# Altium project SDRdrum_Arty_RevB.PrjPcb
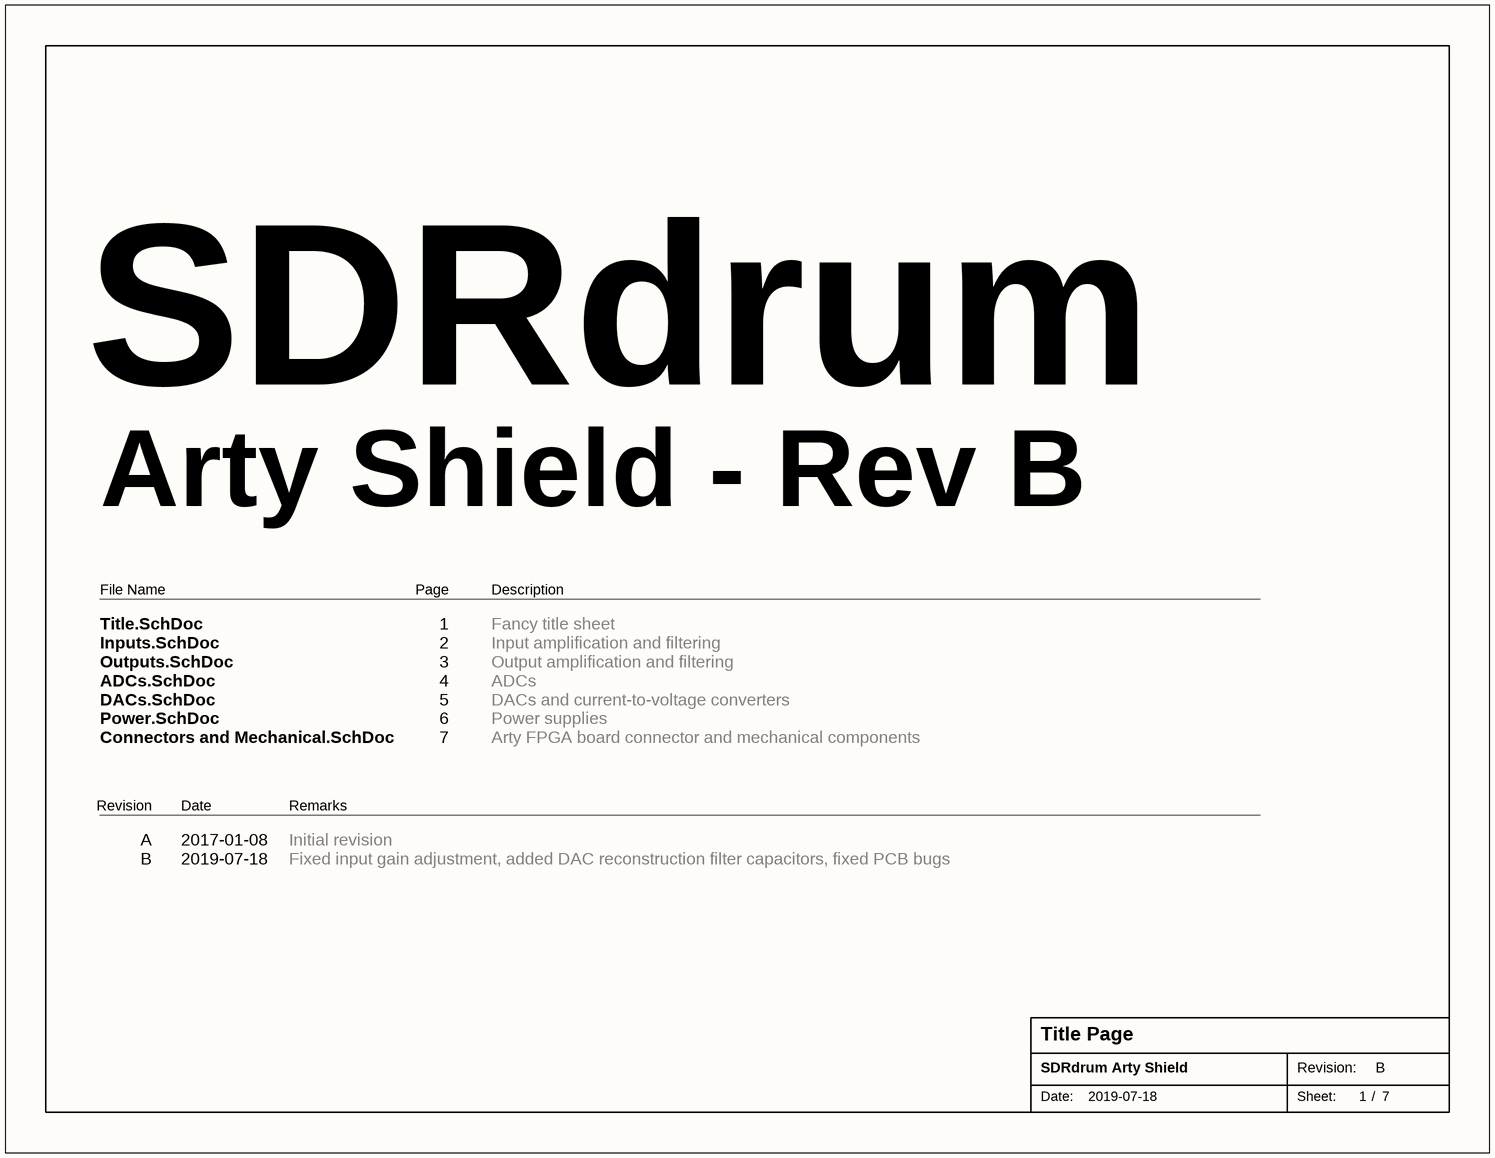
[diagram p0: Title.SchDoc]
ProjectRevision: B
7 sheets, 111 parts. Net scope: global (net labels, ports and power ports of the same name join across sheets).
Board file: SDRdrum_Arty_RevB.PcbDoc
Sheets:
  Title.SchDoc
  Inputs.SchDoc
  Outputs.SchDoc
  ADCs.SchDoc
  DACs.SchDoc
  Power.SchDoc
  Connectors and Mechanical.SchDoc

## Sheet Title.SchDoc: Title Page
size Letter; Date: 2019-07-18; DocumentNumber: 1; Revision: B; SheetNumber: 1; SheetTotal: 7; ProjectTitle: SDRdrum Arty Shield; PageSetup: Record=PageOptions|CenterHorizontal=True|CenterVertical=True|PrintScale=0.98|XCorrection=1.00|YCorrection=1.00|PrintKind=2|BorderSize=5000000|LeftOffset=0|BottomOffset=0|Orientation=2|PaperLength=1000|PaperWidth=1000|Scale=100|PaperSource=7|PrintQuality=-3|MediaType=1|DitherType=10|PrintScaleMode=1|PaperKind=Tabloid|PaperIndex=3

### Notes on the sheet
- SDRdrum
- Arty Shield - Rev B
- File Name
- Page
- Description
- Title.SchDoc
  Inputs.SchDoc
  Outputs.SchDoc
  ADCs.SchDoc
  DACs.SchDoc
  Power.SchDoc
  Connectors and Mechanical.SchDoc
- 1
  2
  3
  4
  5
  6
  7
- Fancy title sheet
  Input amplification and filtering
  Output amplification and filtering
  ADCs
  DACs and current-to-voltage converters
  Power supplies
  Arty FPGA board connector and mechanical components
- Revision
- Date
- Remarks
- A
  B
- 2017-01-08
  2019-07-18
- Initial revision
  Fixed input gain adjustment, added DAC reconstruction filter capacitors, fixed PCB bugs
- Date:
- Revision:
- Sheet:
- /

## Sheet Inputs.SchDoc: Inputs
size Letter; Date: 2019-07-18; DocumentNumber: 2; Revision: B; SheetNumber: 2; SheetTotal: 7; ProjectTitle: SDRdrum Arty Shield; PageSetup: Record=PageOptions|CenterHorizontal=True|CenterVertical=True|PrintScale=0.98|XCorrection=1.00|YCorrection=1.00|PrintKind=2|BorderSize=5000000|LeftOffset=0|BottomOffset=0|Orientation=2|PaperLength=1000|PaperWidth=1000|Scale=100|PaperSource=7|PrintQuality=-3|MediaType=1|DitherType=10|PrintScaleMode=1|PaperKind=Tabloid|PaperIndex=3
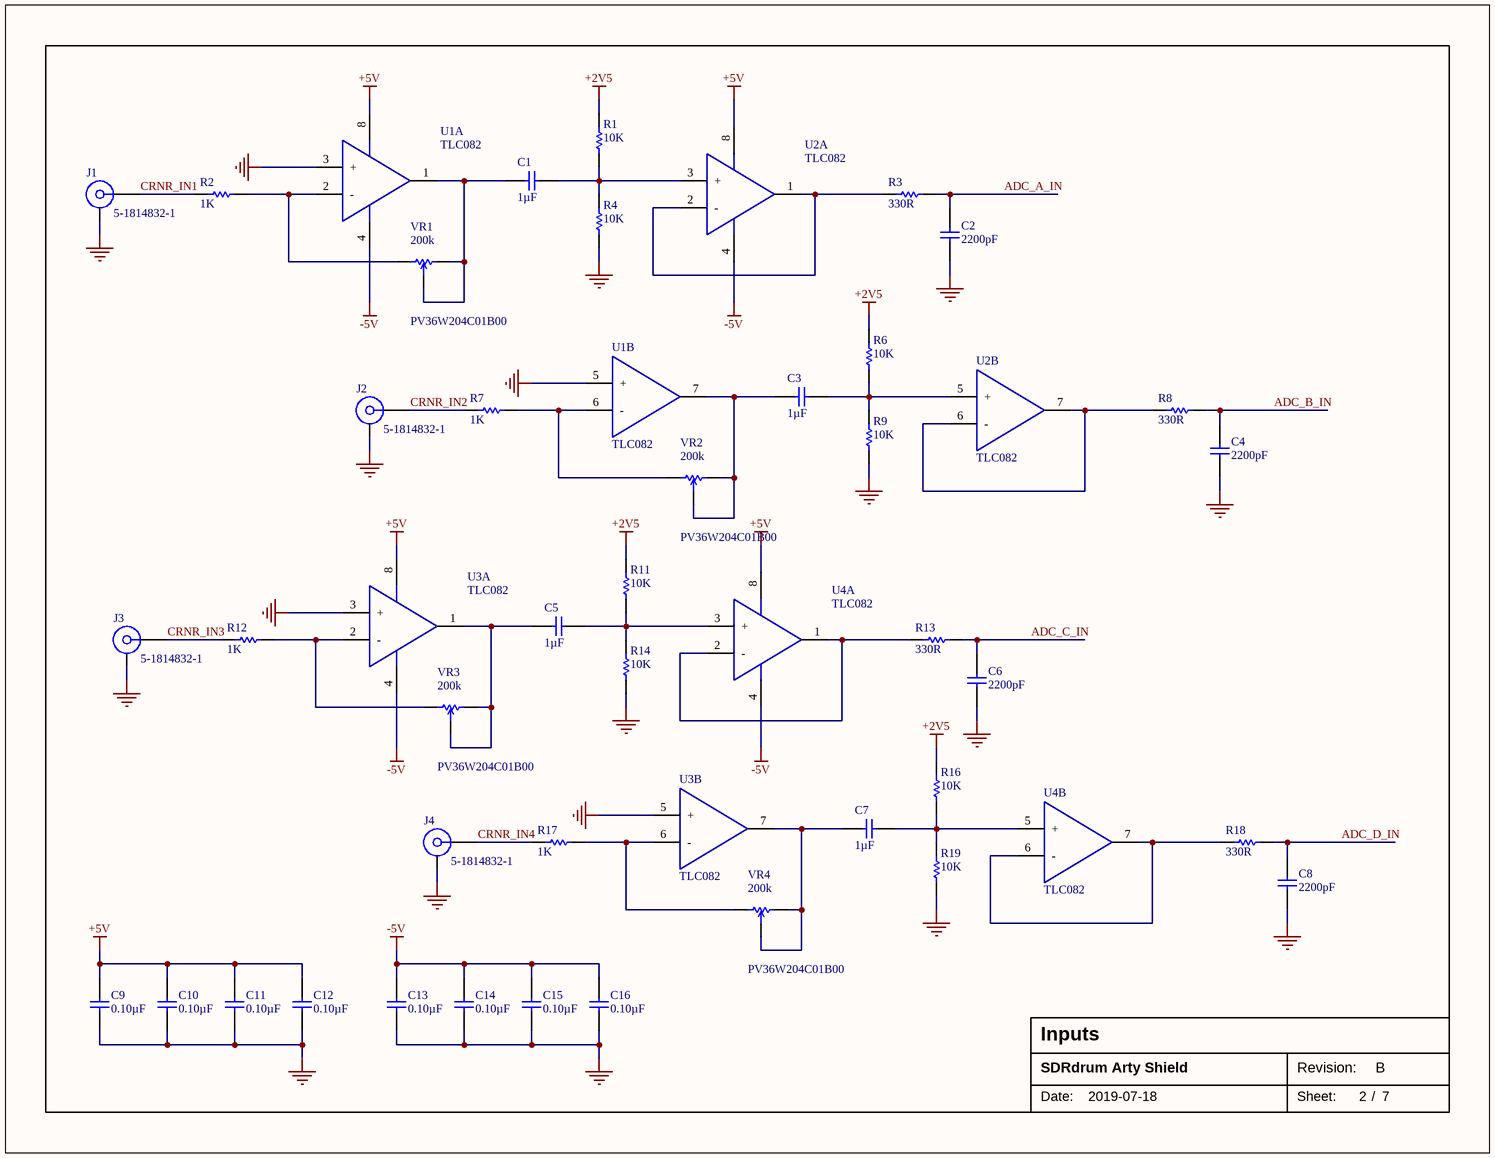
[diagram p1: Inputs.SchDoc]

### Parts
C1  value 1µF  [CAP-0402-M]  (hidden comment: Capacitor)
C2  value 2200pF  [CAP-0402-M]  (hidden comment: CAP 2200pF ±10% 25V 0402 X7R)
C3  value 1µF  [CAP-0402-M]  (hidden comment: Capacitor)
C4  value 2200pF  [CAP-0402-M]  (hidden comment: CAP 2200pF ±10% 25V 0402 X7R)
C5  value 1µF  [CAP-0402-M]  (hidden comment: Capacitor)
C6  value 2200pF  [CAP-0402-M]  (hidden comment: CAP 2200pF ±10% 25V 0402 X7R)
C7  value 1µF  [CAP-0402-M]  (hidden comment: Capacitor)
C8  value 2200pF  [CAP-0402-M]  (hidden comment: CAP 2200pF ±10% 25V 0402 X7R)
C9  value 0.10µF  [CAP-0402-M]  (hidden comment: Capacitor)
C10  value 0.10µF  [CAP-0402-M]  (hidden comment: Capacitor)
C11  value 0.10µF  [CAP-0402-M]  (hidden comment: Capacitor)
C12  value 0.10µF  [CAP-0402-M]  (hidden comment: Capacitor)
C13  value 0.10µF  [CAP-0402-M]  (hidden comment: Capacitor)
C14  value 0.10µF  [CAP-0402-M]  (hidden comment: Capacitor)
C15  value 0.10µF  [CAP-0402-M]  (hidden comment: Capacitor)
C16  value 0.10µF  [CAP-0402-M]  (hidden comment: Capacitor)
J1  5-1814832-1  [5-1814832-1]
J2  5-1814832-1  [5-1814832-1]
J3  5-1814832-1  [5-1814832-1]
J4  5-1814832-1  [5-1814832-1]
R1  value 10K  [RES-0603-M]  (hidden comment: RES 10K 1% 1/10 W 0603 ±100ppm/°C)
R2  value 1K  [RES-0603-M]  (hidden comment: Resistor)
R3  value 330R  [RES-0603-M]  (hidden comment: RES 330R 1% 1/10 W 0603 ±100ppm/°C)
R4  value 10K  [RES-0603-M]  (hidden comment: RES 10K 1% 1/10 W 0603 ±100ppm/°C)
R6  value 10K  [RES-0603-M]  (hidden comment: RES 10K 1% 1/10 W 0603 ±100ppm/°C)
R7  value 1K  [RES-0603-M]  (hidden comment: Resistor)
R8  value 330R  [RES-0603-M]  (hidden comment: RES 330R 1% 1/10 W 0603 ±100ppm/°C)
R9  value 10K  [RES-0603-M]  (hidden comment: RES 10K 1% 1/10 W 0603 ±100ppm/°C)
R11  value 10K  [RES-0603-M]  (hidden comment: RES 10K 1% 1/10 W 0603 ±100ppm/°C)
R12  value 1K  [RES-0603-M]  (hidden comment: Resistor)
R13  value 330R  [RES-0603-M]  (hidden comment: RES 330R 1% 1/10 W 0603 ±100ppm/°C)
R14  value 10K  [RES-0603-M]  (hidden comment: RES 10K 1% 1/10 W 0603 ±100ppm/°C)
R16  value 10K  [RES-0603-M]  (hidden comment: RES 10K 1% 1/10 W 0603 ±100ppm/°C)
R17  value 1K  [RES-0603-M]  (hidden comment: Resistor)
R18  value 330R  [RES-0603-M]  (hidden comment: RES 330R 1% 1/10 W 0603 ±100ppm/°C)
R19  value 10K  [RES-0603-M]  (hidden comment: RES 10K 1% 1/10 W 0603 ±100ppm/°C)
U1  TLC082  [SOIC127P600X175-8M]  (parts A,B of 4)
U2  TLC082  [SOIC127P600X175-8M]  (parts A,B of 4)
U3  TLC082  [SOIC127P600X175-8M]  (parts A,B of 4)
U4  TLC082  [SOIC127P600X175-8M]  (parts A,B of 4)
VR1  PV36W204C01B00  value 200k  [PV36W]
VR2  PV36W204C01B00  value 200k  [PV36W]
VR3  PV36W204C01B00  value 200k  [PV36W]
VR4  PV36W204C01B00  value 200k  [PV36W]

### Nets
+2V5: R1.2 R6.2 R11.2 R16.2
+5V: C9.1 C10.1 C11.1 C12.1 U1.8(NC) U2.8(NC) U3.8(NC) U4.8(NC)
-5V: C13.1 C14.1 C15.1 C16.1 U1.4(V-) U2.4(V-) U3.4(V-) U4.4(V-)
GND: C2.1 C4.1 C6.1 C8.1 C9.2 C10.2 C11.2 C12.2 C13.2 C14.2 C15.2 C16.2 J1.MH J2.MH J3.MH J4.MH R4.1 R9.1 R14.1 R19.1 U1.3(+) U1.5(+) U3.3(+) U3.5(+)
ADC_A_IN: C2.2 R3.2
ADC_B_IN: C4.2 R8.2
ADC_C_IN: C6.2 R13.2
ADC_D_IN: C8.2 R18.2
CRNR_IN1: J1.1 R2.2
CRNR_IN2: J2.1 R7.2
CRNR_IN3: J3.1 R12.2
CRNR_IN4: J4.1 R17.2
NetC1_1: C1.1 U1.1(NC) VR1.2 VR1.3
NetC1_2: C1.2 R1.1 R4.2 U2.3(+)
NetC3_1: C3.1 U1.7(OUT1) VR2.2 VR2.3
NetC3_2: C3.2 R6.1 R9.2 U2.5(+)
NetC5_1: C5.1 U3.1(NC) VR3.2 VR3.3
NetC5_2: C5.2 R11.1 R14.2 U4.3(+)
NetC7_1: C7.1 U3.7(OUT1) VR4.2 VR4.3
NetC7_2: C7.2 R16.1 R19.2 U4.5(+)
NetR2_1: R2.1 U1.2(-) VR1.1
NetR3_1: R3.1 U2.1(NC) U2.2(-)
NetR7_1: R7.1 U1.6(-) VR2.1
NetR8_1: R8.1 U2.6(-) U2.7(OUT1)
NetR12_1: R12.1 U3.2(-) VR3.1
NetR13_1: R13.1 U4.1(NC) U4.2(-)
NetR17_1: R17.1 U3.6(-) VR4.1
NetR18_1: R18.1 U4.6(-) U4.7(OUT1)

### Notes on the sheet
- Date:
- Revision:
- Sheet:
- /

### Library data of the parts
C1 C3 C5 C7 = CC0402KRX5R6BB105: Manufacturer: Yageo; Manufacturer Series: CC; Tolerance: ±10%; Voltage: 10V; Temperature Coefficient: X5R; Part Number: CC0402KRX5R6BB105; Component Type: Standard; Package: 0402; Temperature Range: -55°C ~ 85°C; Supplier 1: Digi-Key; Supplier Part Number 1: 311-1439-1-ND
C2 C4 C6 C8 = CC0402KRX7R8BB222: Manufacturer: Yageo; Manufacturer Series: CC; Part Number: CC0402KRX7R8BB222; Component Type: Standard; Tolerance: ±10%; Voltage: 25V; Package: 0402; Temperature Coefficient: X7R; Temperature Range: -55°C ~ 125°C; Supplier 1: Digi-Key; Supplier Part Number 1: 311-1714-1-ND
C9-C16 = CC0402KRX5R6BB104: Manufacturer: Yageo; Manufacturer Series: CC; Tolerance: ±10%; Voltage: 10V; Temperature Coefficient: X5R; Part Number: CC0402KRX5R6BB104; Component Type: Standard; Package: 0402; Temperature Range: -55°C ~ 85°C; Supplier 1: Digi-Key; Supplier Part Number 1: 311-1336-1-ND
R1 R4 R6 R9 R11 R14 R16 R19 = RC0603FR-0710KL: Manufacturer: Yageo; Manufacturer Series: RC; Power: 1/10 W; Part Number: RC0603FR-0710KL; Component Type: Standard; Tolerance: 1%; Package: 0603; Temperature Coefficient: ±100ppm/°C; Temperature Range: -55°C ~ 155°C; Supplier 1: Digi-Key; Supplier Part Number 1: 311-10.0KHRCT-ND
R2 R7 R12 R17 = RC0603FR-071KL: Manufacturer: Yageo; Manufacturer Series: RC; Tolerance: 1%; Power: 1/10 W; Temperature Coefficient: ±100ppm/°C; Part Number: RC0603FR-071KL; Component Type: Standard; Package: 0603; Temperature Range: -55°C ~ 155°C; Supplier 1: Digi-Key; Supplier Part Number 1: 311-1.00KHRCT-ND
R3 R8 R13 R18 = RC0603FR-07330RL: Manufacturer: Yageo; Manufacturer Series: RC; Power: 1/10 W; Part Number: RC0603FR-07330RL; Component Type: Standard; Tolerance: 1%; Package: 0603; Temperature Coefficient: ±100ppm/°C; Temperature Range: -55°C ~ 155°C; Supplier 1: Digi-Key; Supplier Part Number 1: 311-330HRCT-ND
U1-U4 = TLC082: 36-V, PrOperational Amplifiers, 8-Pin SOIC
VR1-VR4 = PV36W204C01B00: Potentiometer, 200 k, 10%, 0.5 W, Through Hole; Supplier 1: Digi-Key; Supplier Part Number 1: 490-2882-ND

## Sheet Outputs.SchDoc: Outputs
size Letter; Date: 2019-07-18; DocumentNumber: 3; Revision: B; SheetNumber: 3; SheetTotal: 7; ProjectTitle: SDRdrum Arty Shield; PageSetup: Record=PageOptions|CenterHorizontal=True|CenterVertical=True|PrintScale=0.98|XCorrection=1.00|YCorrection=1.00|PrintKind=2|BorderSize=5000000|LeftOffset=0|BottomOffset=0|Orientation=2|PaperLength=1000|PaperWidth=1000|Scale=100|PaperSource=7|PrintQuality=-3|MediaType=1|DitherType=10|PrintScaleMode=1|PaperKind=Tabloid|PaperIndex=3
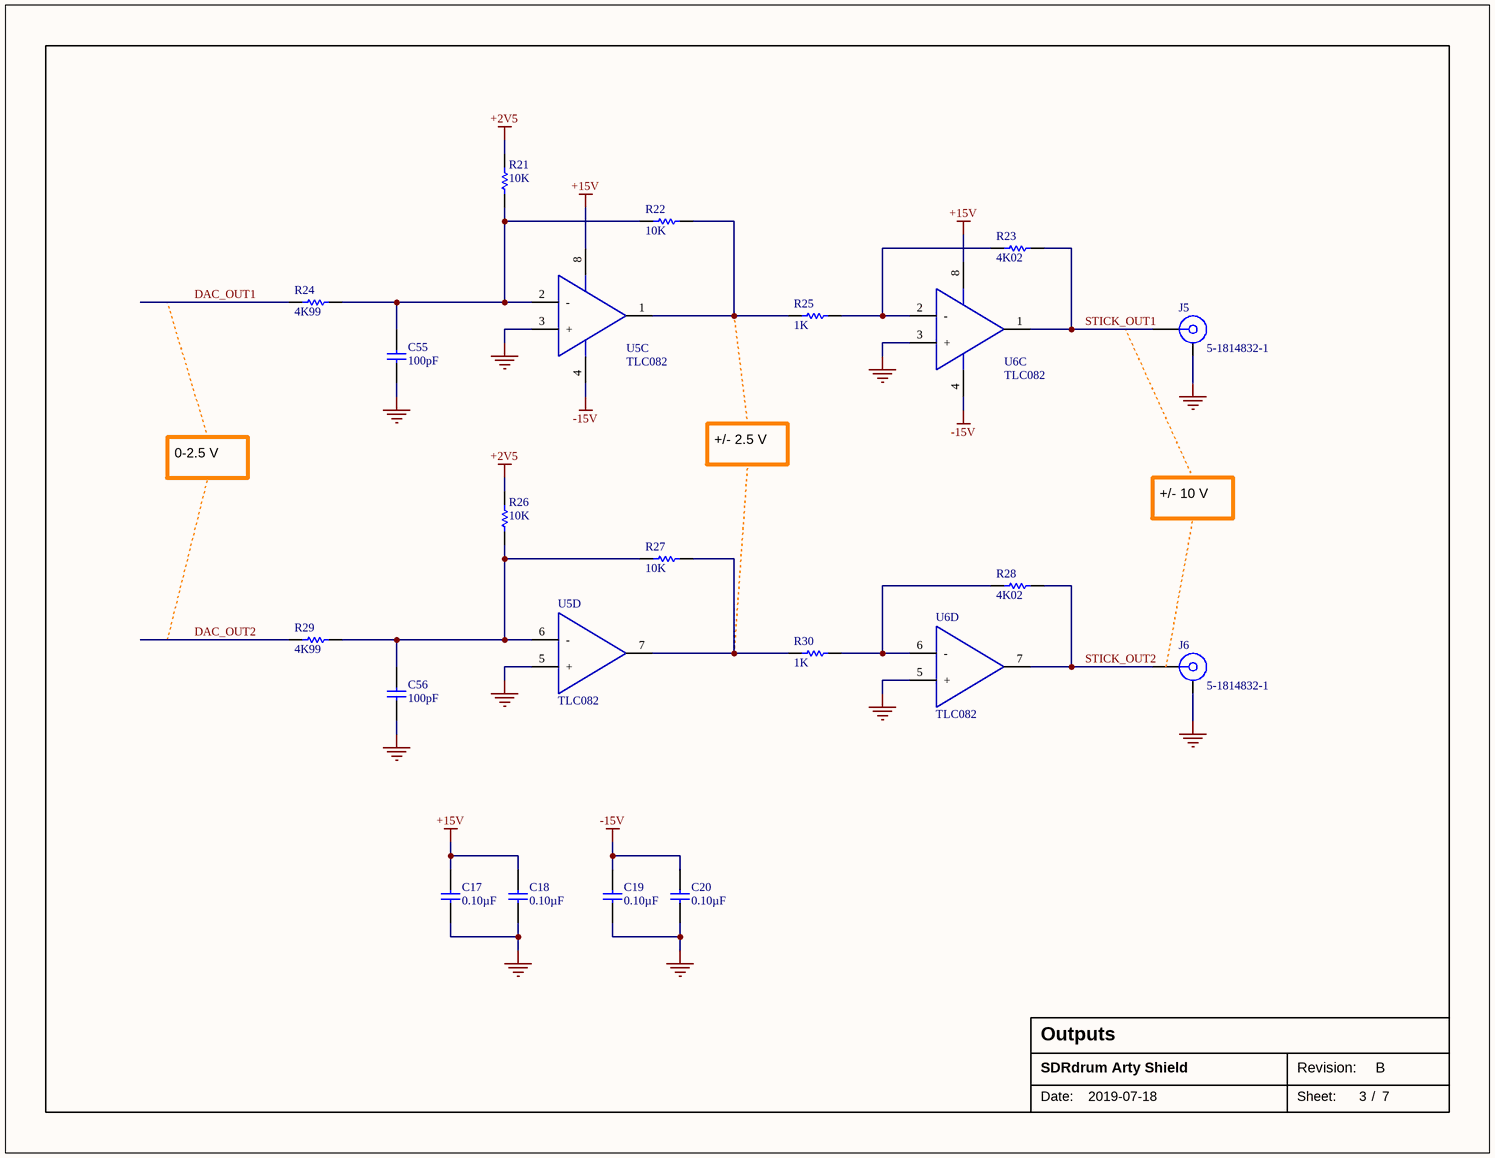
[diagram p2: Outputs.SchDoc]

### Parts
C17  value 0.10µF  [CAP-0402-M]  (hidden comment: Capacitor)
C18  value 0.10µF  [CAP-0402-M]  (hidden comment: Capacitor)
C19  value 0.10µF  [CAP-0402-M]  (hidden comment: Capacitor)
C20  value 0.10µF  [CAP-0402-M]  (hidden comment: Capacitor)
C55  value 100pF  [CAP-0603-M]  (hidden comment: CAP 100pF ±5% 50V 0603 C0G, NP0)
C56  value 100pF  [CAP-0603-M]  (hidden comment: CAP 100pF ±5% 50V 0603 C0G, NP0)
J5  5-1814832-1  [5-1814832-1]
J6  5-1814832-1  [5-1814832-1]
R21  value 10K  [RES-0603-M]  (hidden comment: RES 10K 1% 1/10 W 0603 ±100ppm/°C)
R22  value 10K  [RES-0603-M]  (hidden comment: RES 10K 1% 1/10 W 0603 ±100ppm/°C)
R23  value 4K02  [RES-0603-M]  (hidden comment: RES 4K02 1% 1/10 W 0603 ±100ppm/°C)
R24  value 4K99  [RES-0603-M]  (hidden comment: RES 4K99 1% 1/10 W 0603 ±100ppm/°C)
R25  value 1K  [RES-0603-M]  (hidden comment: RES 1K 1% 1/10 W 0603 ±100ppm/°C)
R26  value 10K  [RES-0603-M]  (hidden comment: RES 10K 1% 1/10 W 0603 ±100ppm/°C)
R27  value 10K  [RES-0603-M]  (hidden comment: RES 10K 1% 1/10 W 0603 ±100ppm/°C)
R28  value 4K02  [RES-0603-M]  (hidden comment: RES 4K02 1% 1/10 W 0603 ±100ppm/°C)
R29  value 4K99  [RES-0603-M]  (hidden comment: RES 4K99 1% 1/10 W 0603 ±100ppm/°C)
R30  value 1K  [RES-0603-M]  (hidden comment: RES 1K 1% 1/10 W 0603 ±100ppm/°C)
U5  TLC082  [SOIC127P600X175-8M]  (parts C,D of 4)
U6  TLC082  [SOIC127P600X175-8M]  (parts C,D of 4)

### Nets
+2V5: R21.2 R26.2
+15V: C17.1 C18.1 U5.8(V+) U6.8(V+)
-15V: C19.1 C20.1 U5.4(V-) U6.4(V-)
GND: C17.2 C18.2 C19.2 C20.2 C55.1 C56.1 J5.MH J6.MH U5.3(+) U5.5(+) U6.3(+) U6.5(+)
DAC_OUT1: R24.1
DAC_OUT2: R29.1
STICK_OUT1: J5.1 R23.2 U6.1(OUT1)
STICK_OUT2: J6.1 R28.2 U6.7(OUT1)
NetC55_2: C55.2 R21.1 R22.1 R24.2 U5.2(-)
NetC56_2: C56.2 R26.1 R27.1 R29.2 U5.6(-)
NetR22_2: R22.2 R25.1 U5.1(OUT1)
NetR23_1: R23.1 R25.2 U6.2(-)
NetR27_2: R27.2 R30.1 U5.7(OUT1)
NetR28_1: R28.1 R30.2 U6.6(-)

### Notes on the sheet
- 0-2.5 V
- +/- 2.5 V
- +/- 10 V
- Date:
- Revision:
- Sheet:
- /

### Library data of the parts
C17-C20 = CC0402KRX5R6BB104: as C9 on sheet Inputs; Part Number: CC0402KRX5R6BB104; Component Type: Standard; Package: 0402; Temperature Range: -55°C ~ 85°C; Supplier 1: Digi-Key; Supplier Part Number 1: 311-1336-1-ND
C55 C56 = CC0603JRNPO9BN101: Manufacturer: Yageo; Manufacturer Series: CC; Part Number: CC0603JRNPO9BN101; Component Type: Standard; Tolerance: ±5%; Voltage: 50V; Package: 0603; Temperature Coefficient: C0G, NP0; Temperature Range: -55°C ~ 125°C; Supplier 1: Digi-Key; Supplier Part Number 1: 311-1069-1-ND
R21 R22 R26 R27 = RC0603FR-0710KL: as R1 on sheet Inputs; Part Number: RC0603FR-0710KL; Component Type: Standard; Tolerance: 1%; Package: 0603; Temperature Coefficient: ±100ppm/°C; Temperature Range: -55°C ~ 155°C; Supplier 1: Digi-Key; Supplier Part Number 1: 311-10.0KHRCT-ND
R23 R28 = RC0603FR-074K02L: Manufacturer: Yageo; Manufacturer Series: RC; Power: 1/10 W; Part Number: RC0603FR-074K02L; Component Type: Standard; Tolerance: 1%; Package: 0603; Temperature Coefficient: ±100ppm/°C; Temperature Range: -55°C ~ 155°C; Supplier 1: Digi-Key; Supplier Part Number 1: 311-4.02KHRCT-ND
R24 R29 = RC0603FR-074K99L: Manufacturer: Yageo; Manufacturer Series: RC; Power: 1/10 W; Part Number: RC0603FR-074K99L; Component Type: Standard; Tolerance: 1%; Package: 0603; Temperature Coefficient: ±100ppm/°C; Temperature Range: -55°C ~ 155°C; Supplier 1: Digi-Key; Supplier Part Number 1: 311-4.99KHRCT-ND
R25 R30 = RC0603FR-071KL: Manufacturer: Yageo; Manufacturer Series: RC; Power: 1/10 W; Part Number: RC0603FR-071KL; Component Type: Standard; Tolerance: 1%; Package: 0603; Temperature Coefficient: ±100ppm/°C; Temperature Range: -55°C ~ 155°C; Supplier 1: Digi-Key; Supplier Part Number 1: 311-1.00KHRCT-ND
U5 U6 = TLC082: as U1 on sheet Inputs

## Sheet ADCs.SchDoc: ADCs
size Letter; Date: 2019-07-18; DocumentNumber: 4; Revision: B; SheetNumber: 4; SheetTotal: 7; ProjectTitle: SDRdrum Arty Shield; PageSetup: Record=PageOptions|CenterHorizontal=True|CenterVertical=True|PrintScale=0.98|XCorrection=1.00|YCorrection=1.00|PrintKind=2|BorderSize=5000000|LeftOffset=0|BottomOffset=0|Orientation=2|PaperLength=1000|PaperWidth=1000|Scale=100|PaperSource=7|PrintQuality=-3|MediaType=1|DitherType=10|PrintScaleMode=1|PaperKind=Tabloid|PaperIndex=3
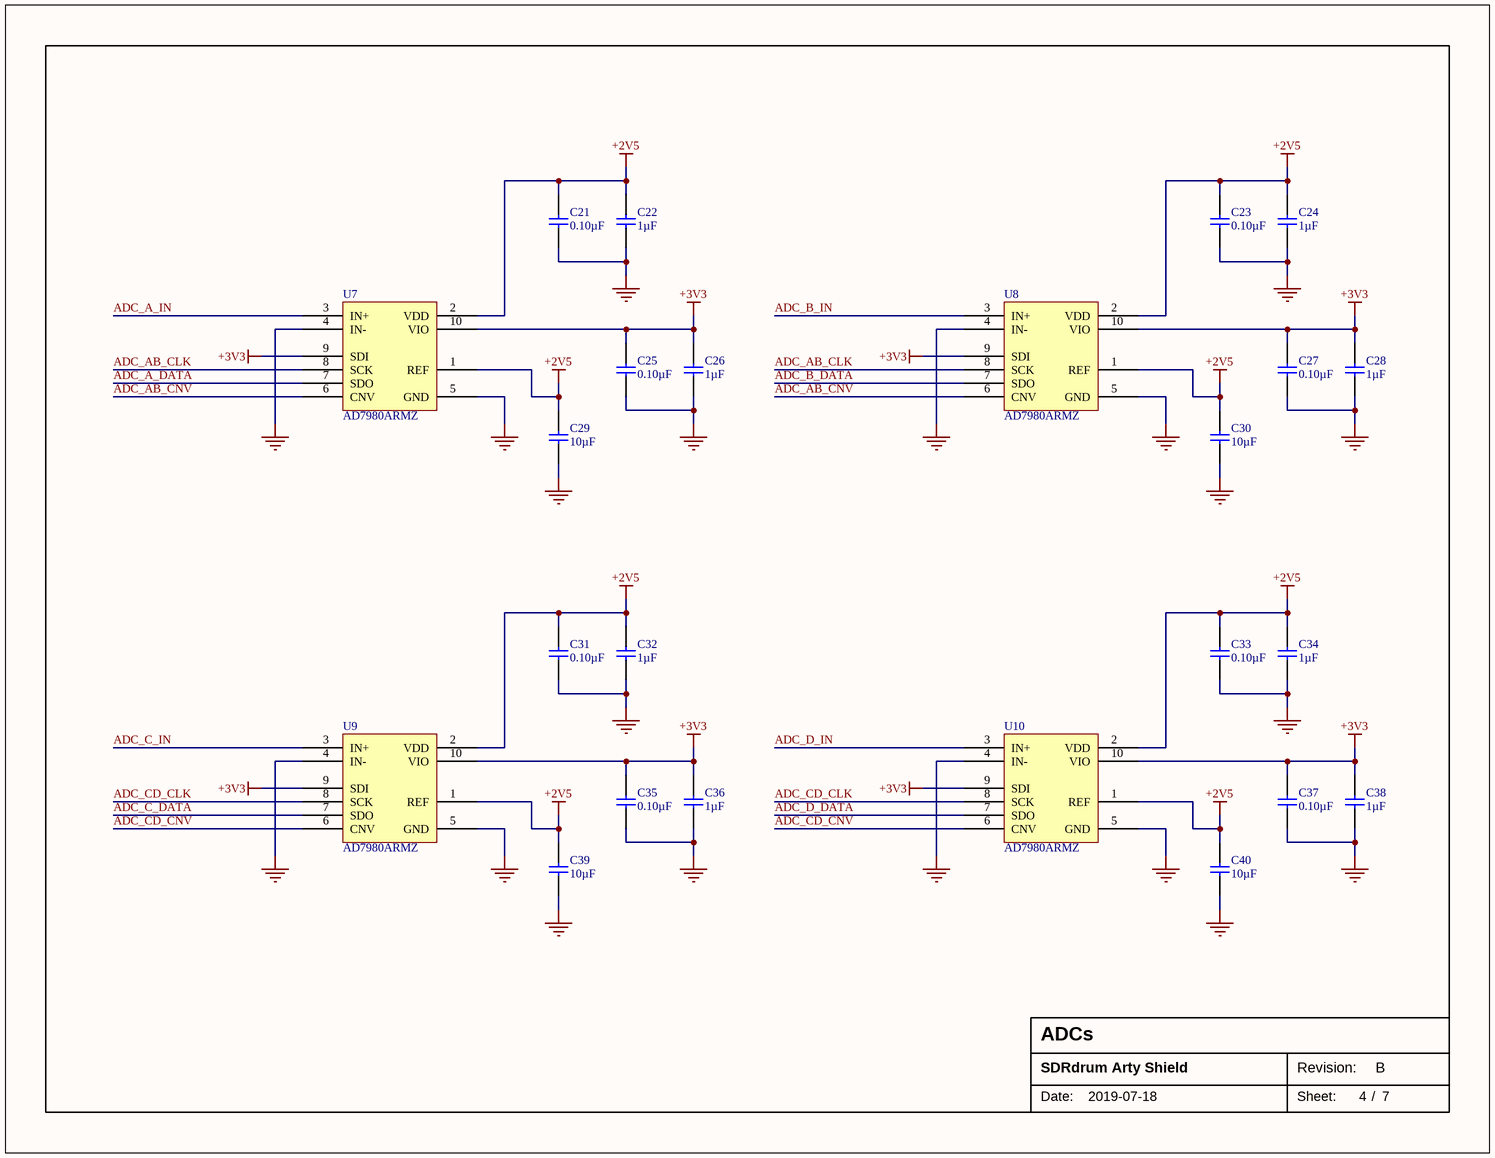
[diagram p3: ADCs.SchDoc]

### Parts
C21  value 0.10µF  [CAP-0402-M]  (hidden comment: Capacitor)
C22  value 1µF  [CAP-0402-M]  (hidden comment: Capacitor)
C23  value 0.10µF  [CAP-0402-M]  (hidden comment: Capacitor)
C24  value 1µF  [CAP-0402-M]  (hidden comment: Capacitor)
C25  value 0.10µF  [CAP-0402-M]  (hidden comment: Capacitor)
C26  value 1µF  [CAP-0402-M]  (hidden comment: Capacitor)
C27  value 0.10µF  [CAP-0402-M]  (hidden comment: Capacitor)
C28  value 1µF  [CAP-0402-M]  (hidden comment: Capacitor)
C29  value 10µF  [CAP-0805-M]  (hidden comment: Capacitor)
C30  value 10µF  [CAP-0805-M]  (hidden comment: Capacitor)
C31  value 0.10µF  [CAP-0402-M]  (hidden comment: Capacitor)
C32  value 1µF  [CAP-0402-M]  (hidden comment: Capacitor)
C33  value 0.10µF  [CAP-0402-M]  (hidden comment: Capacitor)
C34  value 1µF  [CAP-0402-M]  (hidden comment: Capacitor)
C35  value 0.10µF  [CAP-0402-M]  (hidden comment: Capacitor)
C36  value 1µF  [CAP-0402-M]  (hidden comment: Capacitor)
C37  value 0.10µF  [CAP-0402-M]  (hidden comment: Capacitor)
C38  value 1µF  [CAP-0402-M]  (hidden comment: Capacitor)
C39  value 10µF  [CAP-0805-M]  (hidden comment: Capacitor)
C40  value 10µF  [CAP-0805-M]  (hidden comment: Capacitor)
U7  AD7980ARMZ  [TSSOP50P490X110-10N]
U8  AD7980ARMZ  [TSSOP50P490X110-10N]
U9  AD7980ARMZ  [TSSOP50P490X110-10N]
U10  AD7980ARMZ  [TSSOP50P490X110-10N]

### Nets
+2V5: C21.1 C22.1 C23.1 C24.1 C29.2 C30.2 C31.1 C32.1 C33.1 C34.1 C39.2 C40.2 U7.1(REF) U7.2(VDD) U8.1(REF) U8.2(VDD) U9.1(REF) U9.2(VDD) U10.1(REF) U10.2(VDD)
+3V3: C25.1 C26.1 C27.1 C28.1 C35.1 C36.1 C37.1 C38.1 U7.9(SDI) U7.10(VIO) U8.9(SDI) U8.10(VIO) U9.9(SDI) U9.10(VIO) U10.9(SDI) U10.10(VIO)
GND: C21.2 C22.2 C23.2 C24.2 C25.2 C26.2 C27.2 C28.2 C29.1 C30.1 C31.2 C32.2 C33.2 C34.2 C35.2 C36.2 C37.2 C38.2 C39.1 C40.1 U7.4(IN-) U7.5(GND) U8.4(IN-) U8.5(GND) U9.4(IN-) U9.5(GND) U10.4(IN-) U10.5(GND)
ADC_A_DATA: U7.7(SDO)
ADC_A_IN: U7.3(IN+)
ADC_AB_CLK: U7.8(SCK) U8.8(SCK)
ADC_AB_CNV: U7.6(CNV) U8.6(CNV)
ADC_B_DATA: U8.7(SDO)
ADC_B_IN: U8.3(IN+)
ADC_C_DATA: U9.7(SDO)
ADC_C_IN: U9.3(IN+)
ADC_CD_CLK: U9.8(SCK) U10.8(SCK)
ADC_CD_CNV: U9.6(CNV) U10.6(CNV)
ADC_D_DATA: U10.7(SDO)
ADC_D_IN: U10.3(IN+)

### Notes on the sheet
- Date:
- Revision:
- Sheet:
- /

### Library data of the parts
C21 C23 C25 C27 C31 C33 C35 C37 = CC0402KRX5R6BB104: as C9 on sheet Inputs; Part Number: CC0402KRX5R6BB104; Component Type: Standard; Package: 0402; Temperature Range: -55°C ~ 85°C; Supplier 1: Digi-Key; Supplier Part Number 1: 311-1336-1-ND
C22 C24 C26 C28 C32 C34 C36 C38 = CC0402KRX5R6BB105: as C1 on sheet Inputs; Part Number: CC0402KRX5R6BB105; Component Type: Standard; Package: 0402; Temperature Range: -55°C ~ 85°C; Supplier 1: Digi-Key; Supplier Part Number 1: 311-1439-1-ND
C29 C30 C39 C40 = CC0805KKX5R6BB106: Manufacturer: Yageo; Manufacturer Series: CC; Tolerance: ±10%; Voltage: 10V; Temperature Coefficient: X5R; Part Number: CC0805KKX5R6BB106; Component Type: Standard; Package: 0805; Temperature Range: -55°C ~ 85°C; Supplier 1: Digi-Key; Supplier Part Number 1: 311-1460-1-ND

## Sheet DACs.SchDoc: DACs
size Letter; Date: 2019-07-18; DocumentNumber: 5; Revision: B; SheetNumber: 5; SheetTotal: 7; ProjectTitle: SDRdrum Arty Shield; PageSetup: Record=PageOptions|CenterHorizontal=True|CenterVertical=True|PrintScale=0.98|XCorrection=1.00|YCorrection=1.00|PrintKind=2|BorderSize=5000000|LeftOffset=0|BottomOffset=0|Orientation=2|PaperLength=1000|PaperWidth=1000|Scale=100|PaperSource=7|PrintQuality=-3|MediaType=1|DitherType=10|PrintScaleMode=1|PaperKind=Tabloid|PaperIndex=3
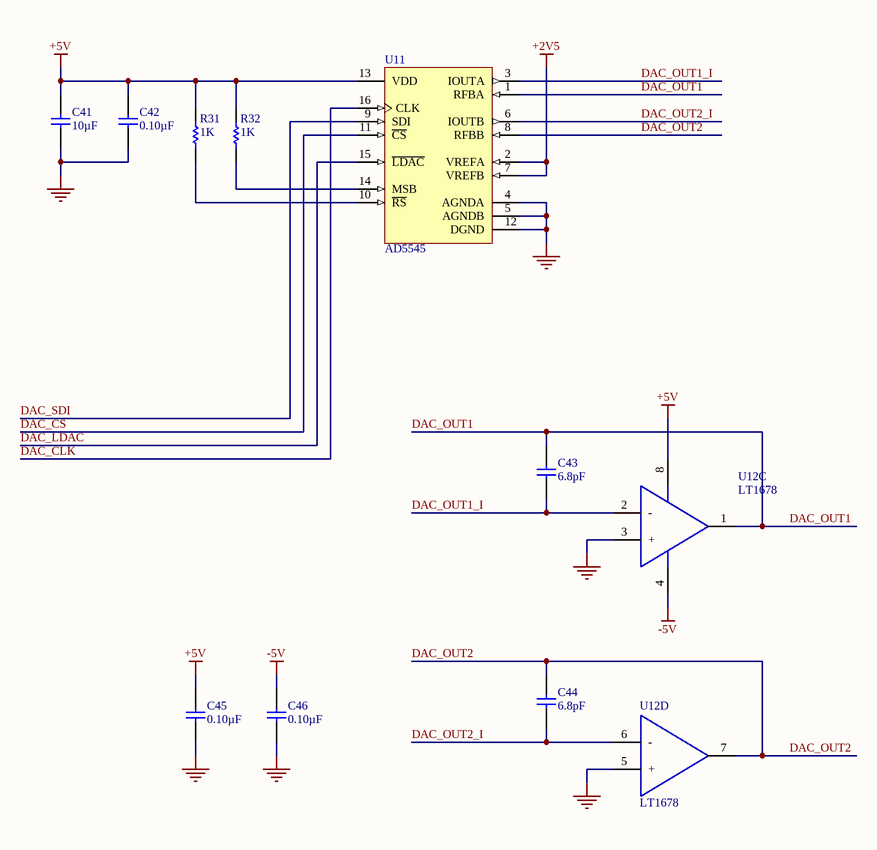
[diagram p4: DACs.SchDoc]

### Parts
C41  value 10µF  [CAP-0805-M]  (hidden comment: Capacitor)
C42  value 0.10µF  [CAP-0402-M]  (hidden comment: Capacitor)
C43  value 6.8pF  [CAP-0402-M]  (hidden comment: CAP 6.8pF ±0.5pF 50V 0402 C0G, NP0)
C44  value 6.8pF  [CAP-0402-M]  (hidden comment: CAP 6.8pF ±0.5pF 50V 0402 C0G, NP0)
C45  value 0.10µF  [CAP-0402-M]  (hidden comment: Capacitor)
C46  value 0.10µF  [CAP-0402-M]  (hidden comment: Capacitor)
R31  value 1K  [RES-0603-M]  (hidden comment: Resistor)
R32  value 1K  [RES-0603-M]  (hidden comment: Resistor)
U11  AD5545  [TSOP65P640X120-16N]
U12  LT1678  [SOIC127P600X175-8M]  (parts C,D of 4)

### Nets
+2V5: U11.2(VREFA) U11.7(VREFB)
+5V: C41.2 C42.1 C45.1 R31.1 R32.1 U11.13(VDD) U12.8(V+)
-5V: C46.1 U12.4(V-)
GND: C41.1 C42.2 C45.2 C46.2 U11.4(AGNDA) U11.5(AGNDB) U11.12(DGND) U12.3(+) U12.5(+)
DAC_CLK: U11.16(CLK)
DAC_CS: U11.11(~{CS})
DAC_LDAC: U11.15(~{LDAC})
DAC_OUT1: C43.2 U11.1(RFBA) U12.1(OUT1)
DAC_OUT1_I: C43.1 U11.3(IOUTA) U12.2(-)
DAC_OUT2: C44.2 U11.8(RFBB) U12.7(OUT1)
DAC_OUT2_I: C44.1 U11.6(IOUTB) U12.6(-)
DAC_SDI: U11.9(SDI)
NetR31_2: R31.2 U11.10(~{RS})
NetR32_2: R32.2 U11.14(MSB)

### Notes on the sheet
- Date:
- Revision:
- Sheet:
- /

### Library data of the parts
C41 = CC0805KKX5R6BB106: as C29 on sheet ADCs; Part Number: CC0805KKX5R6BB106; Component Type: Standard; Package: 0805; Temperature Range: -55°C ~ 85°C; Supplier 1: Digi-Key; Supplier Part Number 1: 311-1460-1-ND
C42 C45 C46 = CC0402KRX5R6BB104: as C9 on sheet Inputs; Part Number: CC0402KRX5R6BB104; Component Type: Standard; Package: 0402; Temperature Range: -55°C ~ 85°C; Supplier 1: Digi-Key; Supplier Part Number 1: 311-1336-1-ND
C43 C44 = CC0402DRNPO9BN6R8: Manufacturer: Yageo; Manufacturer Series: CC; Part Number: CC0402DRNPO9BN6R8; Component Type: Standard; Tolerance: ±0.5pF; Voltage: 50V; Package: 0402; Temperature Coefficient: C0G, NP0; Temperature Range: -55°C ~ 125°C; Supplier 1: Digi-Key; Supplier Part Number 1: 311-1637-1-ND
R31 R32 = RC0603FR-071KL: as R2 on sheet Inputs; Part Number: RC0603FR-071KL; Component Type: Standard; Package: 0603; Temperature Range: -55°C ~ 155°C; Supplier 1: Digi-Key; Supplier Part Number 1: 311-1.00KHRCT-ND
U11 = AD5545: Dual, Current-Output, Serial-Input, 16-Bit DAC, 16-Pin TSSOP; Supplier 1: Digi-Key; Supplier Part Number 1: AD5545BRUZ-ND
U12 = LT1678: Dual/Quad Low Noise, Rail-to-Rail, Precision Op Amps, 8-Pin SOIC; Supplier 1: Digi-Key; Supplier Part Number 1: LT1678CS8#PBF-ND

## Sheet Power.SchDoc: Power Supplies
size Letter; Date: 2019-07-18; DocumentNumber: 6; Revision: B; SheetNumber: 6; SheetTotal: 7; ProjectTitle: SDRdrum Arty Shield; PageSetup: Record=PageOptions|CenterHorizontal=True|CenterVertical=True|PrintScale=0.98|XCorrection=1.00|YCorrection=1.00|PrintKind=2|BorderSize=5000000|LeftOffset=0|BottomOffset=0|Orientation=2|PaperLength=1000|PaperWidth=1000|Scale=100|PaperSource=7|PrintQuality=-3|MediaType=1|DitherType=10|PrintScaleMode=1|PaperKind=Tabloid|PaperIndex=3
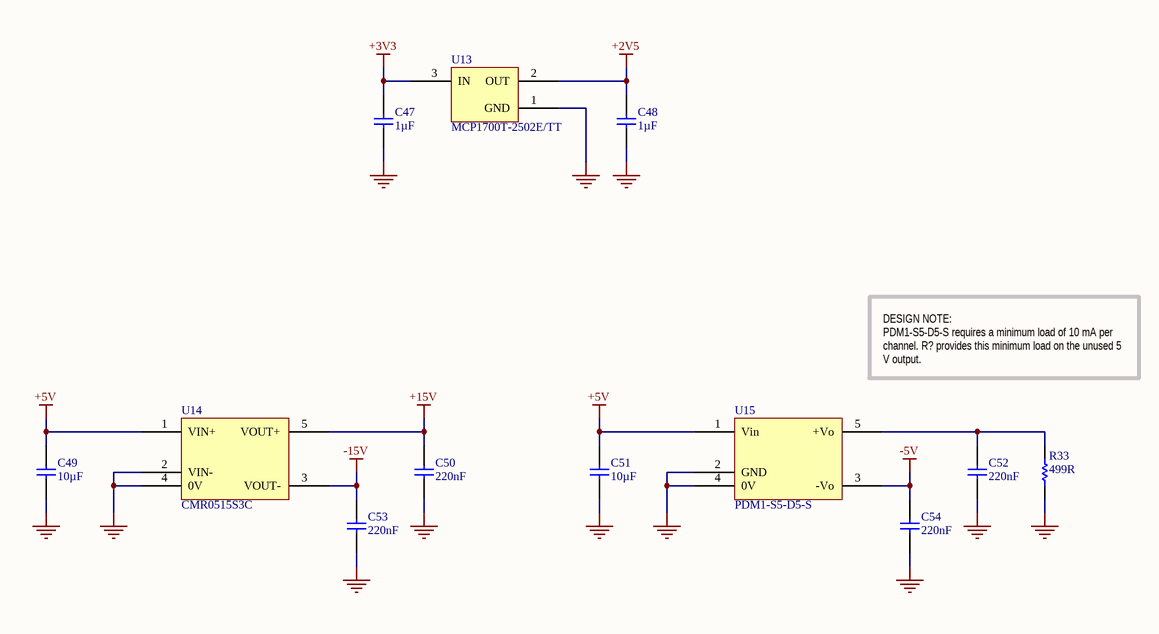
[diagram p5: Power.SchDoc]

### Parts
C47  value 1µF  [CAP-0402-M]  (hidden comment: Capacitor)
C48  value 1µF  [CAP-0402-M]  (hidden comment: Capacitor)
C49  value 10µF  [CAP-0805-M]  (hidden comment: Capacitor)
C50  value 220nF  [CAP-0805-M]  (hidden comment: CAP 220nF ±10% 25V 0805 X7R)
C51  value 10µF  [CAP-0805-M]  (hidden comment: Capacitor)
C52  value 220nF  [CAP-0805-M]  (hidden comment: CAP 220nF ±10% 25V 0805 X7R)
C53  value 220nF  [CAP-0805-M]  (hidden comment: CAP 220nF ±10% 25V 0805 X7R)
C54  value 220nF  [CAP-0805-M]  (hidden comment: CAP 220nF ±10% 25V 0805 X7R)
R33  value 499R  [RES-0603-M]  (hidden comment: RES 499R 1% 1/10 W 0603 ±100ppm/°C)
U13  MCP1700T-2502E/TT  [SOT65P237X110-3N]
U14  CMR0515S3C  [CMR-3C]
U15  PDM1-S5-D5-S  [PDM-1S]

### Nets
+2V5: C48.1 U13.2(OUT)
+3V3: C47.1 U13.3(IN)
+5V: C49.2 C51.2 U14.1(VIN+) U15.1(Vin)
+15V: C50.2 U14.5(VOUT+)
-5V: C54.2 U15.3(-Vo)
-15V: C53.2 U14.3(VOUT-)
GND: C47.2 C48.2 C49.1 C50.1 C51.1 C52.1 C53.1 C54.1 R33.2 U13.1(GND) U14.2(VIN-) U14.4(0V) U15.2(GND) U15.4(0V)
NetC52_2: C52.2 R33.1 U15.5(+Vo)

### Notes on the sheet
- DESIGN NOTE:
  PDM1-S5-D5-S requires a minimum load of 10 mA per channel. R? provides this minimum load on the unused 5 V output.
- Date:
- Revision:
- Sheet:
- /

### Library data of the parts
C47 C48 = CC0402KRX5R6BB105: as C1 on sheet Inputs; Part Number: CC0402KRX5R6BB105; Component Type: Standard; Package: 0402; Temperature Range: -55°C ~ 85°C; Supplier 1: Digi-Key; Supplier Part Number 1: 311-1439-1-ND
C49 C51 = CC0805KKX5R6BB106: as C29 on sheet ADCs; Part Number: CC0805KKX5R6BB106; Component Type: Standard; Package: 0805; Temperature Range: -55°C ~ 85°C; Supplier 1: Digi-Key; Supplier Part Number 1: 311-1460-1-ND
C50 C52-C54 = CC0805KRX7R8BB224: Manufacturer: Yageo; Manufacturer Series: CC; Part Number: CC0805KRX7R8BB224; Component Type: Standard; Tolerance: ±10%; Voltage: 25V; Package: 0805; Temperature Coefficient: X7R; Temperature Range: -55°C ~ 125°C; Supplier 1: Digi-Key; Supplier Part Number 1: 311-1432-1-ND
R33 = RC0603FR-07499RL: Manufacturer: Yageo; Manufacturer Series: RC; Power: 1/10 W; Part Number: RC0603FR-07499RL; Component Type: Standard; Tolerance: 1%; Package: 0603; Temperature Coefficient: ±100ppm/°C; Temperature Range: -55°C ~ 155°C; Supplier 1: Digi-Key; Supplier Part Number 1: 311-499HRCT-ND
U13 = MCP1700T-2502E/TT: Supplier 1: Digi-Key; Supplier Part Number 1: MCP1700T-2502E/TTCT-ND
U14 = CMR0515S3C: Supplier 1: Digi-Key; Supplier Part Number 1: 811-2900-5-ND

## Sheet Connectors and Mechanical.SchDoc: Connectors and Mechanical
size Letter; Date: 2019-07-18; DocumentNumber: 7; Revision: B; SheetNumber: 7; SheetTotal: 7; ProjectTitle: SDRdrum Arty Shield; PageSetup: Record=PageOptions|CenterHorizontal=True|CenterVertical=True|PrintScale=0.98|XCorrection=1.00|YCorrection=1.00|PrintKind=2|BorderSize=5000000|LeftOffset=0|BottomOffset=0|Orientation=2|PaperLength=1000|PaperWidth=1000|Scale=100|PaperSource=7|PrintQuality=-3|MediaType=1|DitherType=10|PrintScaleMode=1|PaperKind=Tabloid|PaperIndex=3
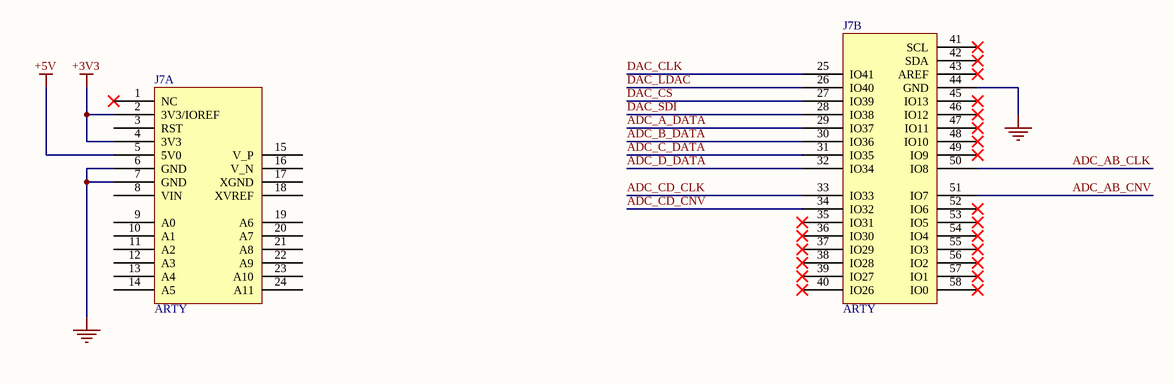
[diagram p6: Connectors and Mechanical.SchDoc]

### Parts
J7  ARTY  [ARTY-TH]  (parts A,B of 2)

### Nets
+3V3: J7.2(3V3/IOREF) J7.4(3V3)
+5V: J7.5(5V0)
GND: J7.6(GND) J7.7(GND) J7.44(GND)
ADC_A_DATA: J7.29(IO37)
ADC_AB_CLK: J7.50(IO8)
ADC_AB_CNV: J7.51(IO7)
ADC_B_DATA: J7.30(IO36)
ADC_C_DATA: J7.31(IO35)
ADC_CD_CLK: J7.33(IO33)
ADC_CD_CNV: J7.34(IO32)
ADC_D_DATA: J7.32(IO34)
DAC_CLK: J7.25(IO41)
DAC_CS: J7.27(IO39)
DAC_LDAC: J7.26(IO40)
DAC_SDI: J7.28(IO38)

Not connected (* = marked no-connect by the designer): J7 1(NC)* 3(RST) 8(VIN) 9(A0) 10(A1) 11(A2) 12(A3) 13(A4) 14(A5) 15(V_P) 16(V_N) 17(XGND) 18(XVREF) 19(A6) 20(A7) 21(A8) 22(A9) 23(A10) 24(A11) 35(IO31)* 36(IO30)* 37(IO29)* 38(IO28)* 39(IO27)* 40(IO26)* 41(SCL)* 42(SDA)* 43(AREF)* 45(IO13)* 46(IO12)* 47(IO11)* 48(IO10)* 49(IO9)* 52(IO6)* 53(IO5)* 54(IO4)* 55(IO3)* 56(IO2)* 57(IO1)* 58(IO0)*

### Notes on the sheet
- Date:
- Revision:
- Sheet:
- /

## Nets that join several sheets
+2V5: Inputs (R1.2 R6.2 R11.2 R16.2), Outputs (R21.2 R26.2), ADCs (20 pins), DACs (U11.2 U11.7), Power (C48.1 U13.2)
+3V3: ADCs (16 pins), Power (C47.1 U13.3), Connectors and Mechanical (J7.2 J7.4)
+5V: Inputs (8 pins), DACs (7 pins), Power (C49.2 C51.2 U14.1 U15.1), Connectors and Mechanical (J7.5)
+15V: Outputs (C17.1 C18.1 U5.8 U6.8), Power (C50.2 U14.5)
-5V: Inputs (8 pins), DACs (C46.1 U12.4), Power (C54.2 U15.3)
-15V: Outputs (C19.1 C20.1 U5.4 U6.4), Power (C53.2 U14.3)
GND: Inputs (24 pins), Outputs (12 pins), ADCs (28 pins), DACs (9 pins), Power (14 pins), Connectors and Mechanical (J7.6 J7.7 J7.44)
ADC_A_DATA: ADCs (U7.7), Connectors and Mechanical (J7.29)
ADC_A_IN: Inputs (C2.2 R3.2), ADCs (U7.3)
ADC_AB_CLK: ADCs (U7.8 U8.8), Connectors and Mechanical (J7.50)
ADC_AB_CNV: ADCs (U7.6 U8.6), Connectors and Mechanical (J7.51)
ADC_B_DATA: ADCs (U8.7), Connectors and Mechanical (J7.30)
ADC_B_IN: Inputs (C4.2 R8.2), ADCs (U8.3)
ADC_C_DATA: ADCs (U9.7), Connectors and Mechanical (J7.31)
ADC_C_IN: Inputs (C6.2 R13.2), ADCs (U9.3)
ADC_CD_CLK: ADCs (U9.8 U10.8), Connectors and Mechanical (J7.33)
ADC_CD_CNV: ADCs (U9.6 U10.6), Connectors and Mechanical (J7.34)
ADC_D_DATA: ADCs (U10.7), Connectors and Mechanical (J7.32)
ADC_D_IN: Inputs (C8.2 R18.2), ADCs (U10.3)
DAC_CLK: DACs (U11.16), Connectors and Mechanical (J7.25)
DAC_CS: DACs (U11.11), Connectors and Mechanical (J7.27)
DAC_LDAC: DACs (U11.15), Connectors and Mechanical (J7.26)
DAC_OUT1: Outputs (R24.1), DACs (C43.2 U11.1 U12.1)
DAC_OUT2: Outputs (R29.1), DACs (C44.2 U11.8 U12.7)
DAC_SDI: DACs (U11.9), Connectors and Mechanical (J7.28)